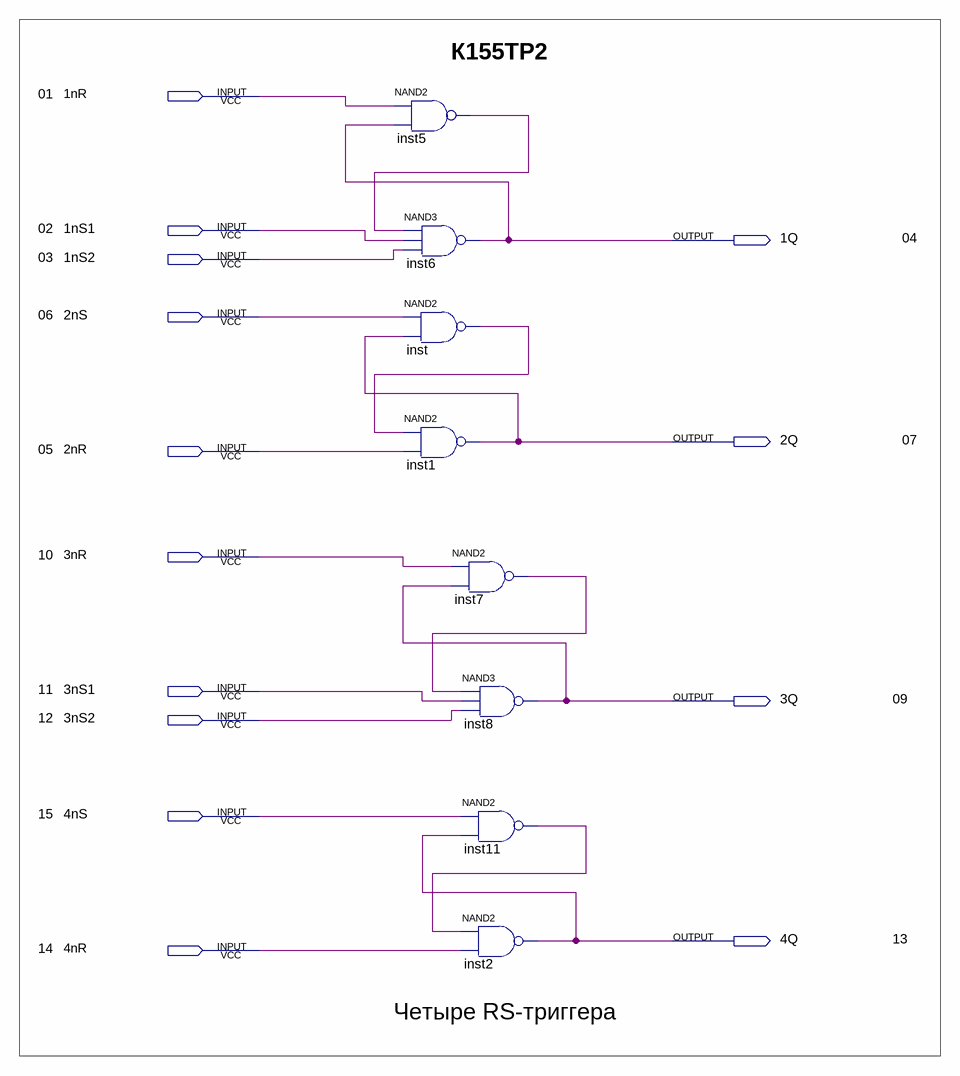
[diagram p0: schematic sheet]
// Quartus schematic K155TR2.bdf as structural Verilog: 8 symbols, 14 pins
module K155TR2 (
  input  \1nR ,
  input  \1nS1 ,
  input  \1nS2 ,
  input  \2nS ,
  input  \2nR ,
  input  \3nR ,
  input  \3nS1 ,
  input  \3nS2 ,
  input  \4nS ,
  input  \4nR ,
  output \1Q ,
  output \2Q ,
  output \3Q ,
  output \4Q 
);

  wire inst5_out, inst7_out, inst11_out, inst_out;

  nand inst5 (inst5_out, \1nR , \1Q );
  nand inst6 (\1Q , inst5_out, \1nS1 , \1nS2 );
  nand inst (inst_out, \2nS , \2Q );
  nand inst1 (\2Q , inst_out, \2nR );
  nand inst7 (inst7_out, \3nR , \3Q );
  nand inst8 (\3Q , inst7_out, \3nS1 , \3nS2 );
  nand inst11 (inst11_out, \4nS , \4Q );
  nand inst2 (\4Q , inst11_out, \4nR );

  // Notes on the sheet:
  //   К155ТР2
  //   01
  //   02
  //   04
  //   03
  //   06
  //   07
  //   05
  //   10
  //   11
  //   09
  //   12
  //   15
  //   13
  //   14
  //   Четыре RS-триггера
endmodule
